# Altium schematic sheet ELEC5550_Team_26_USB_Schematic.SchDoc
size A4; SheetNumber: 3; SheetTotal: 3
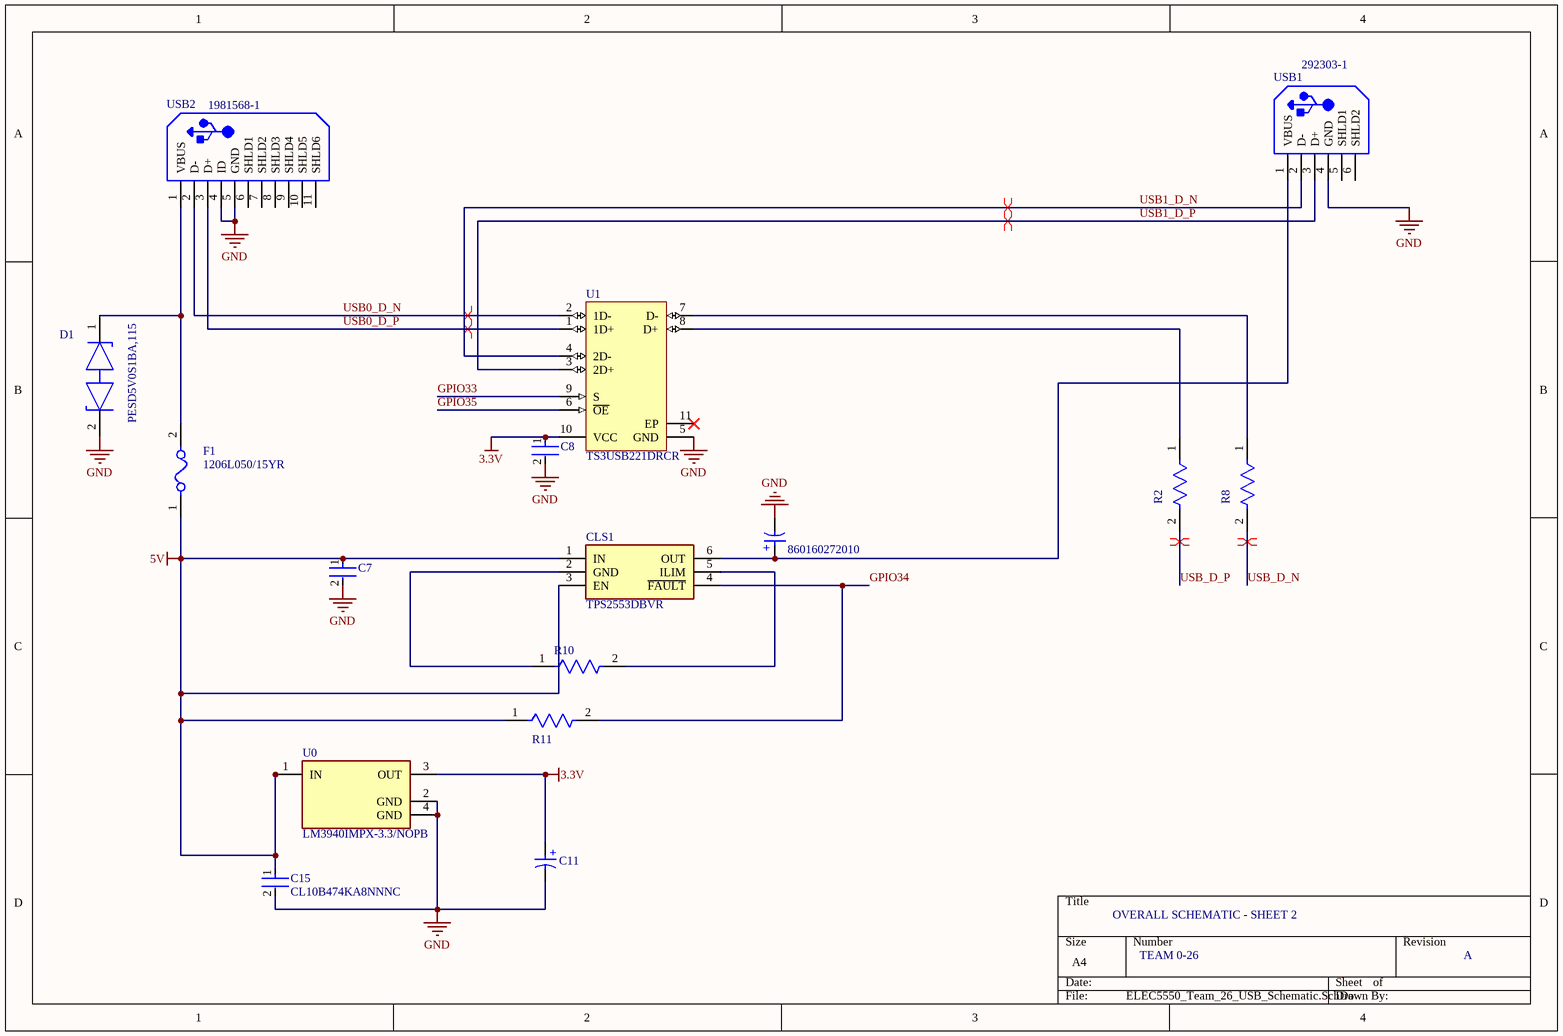
[diagram p0: ELEC5550_Team_26_USB_Schematic.SchDoc]

## Parts
C7  CC0805KRX7R9BB104  [FP-CC0805-0_85-MFG]  (value not drawn)
C8  CC0805KRX7R9BB104  [FP-CC0805-0_85-MFG]  (value not drawn)
C9  860160272010  [WCAP-ATLL_D5H11]
C11  KS336M016C07RR0VH2FP0  [WCAP-ATLL_D5H11]  (value not drawn)
C15  CL10B474KA8NNNC  [FP-GRM188-0_1-e0_2_0_5-MFG]
CLS1  TPS2553DBVR  [SOT95P280X145-6N]
D1  PESD5V0S1BA,115  [FP-SOD323-CA-MFG]
F1  1206L050/15YR  [FP-1206L-MFG]
R2  RC0603JR-0722RL  [FP-RC0603-0_55-IPC_C]  (value not drawn)
R8  RC0603JR-0722RL  [FP-RC0603-0_55-IPC_C]  (value not drawn)
R10  RCT0320KJLF  [FP-RT0603-MFG]  (value not drawn)
R11  RCT03100KJLF  [FP-AT0603-IPC_A]  (value not drawn)
U0  LM3940IMPX-3.3/NOPB  [FP-DCY0004A-MFG]
U1  TS3USB221DRCR  [DRC0010J_V]
USB1  292303-1  [TE-292303-1_V]
USB2  1981568-1  [TECO-1981568-5_V]

## Nets
3.3V: C8.1 C11.1(P) U0.3(OUT) U1.10(VCC)
5V: C7.1 C15.1 CLS1.1(IN) CLS1.3(EN) F1.1 R11.1 U0.1(IN)
GND: C7.2 C8.2 C9.2(N) C11.2(N) C15.2 D1.2(K2) U0.2(GND) U0.4(GND) U1.5(GND) USB1.4(GND) USB2.4(ID) USB2.5(GND)
GPIO33: U1.9(S)
GPIO34: CLS1.4(~{FAULT}) R11.2
GPIO35: U1.6(~{OE})
USB0_D_N: U1.2(1D-) USB2.2(D-)
USB0_D_P: U1.1(1D+) USB2.3(D+)
USB1_D_N: U1.4(2D-) USB1.2(D-)
USB1_D_P: U1.3(2D+) USB1.3(D+)
USB_D_N: R8.2
USB_D_P: R2.2
NetC9_1: C9.1(P) CLS1.6(OUT) USB1.1(VBUS)
NetCLS1_2: CLS1.2(GND) R10.1
NetCLS1_5: CLS1.5(ILIM) R10.2
NetD1_1: D1.1(K1) F1.2 USB2.1(VBUS)
NetR2_1: R2.1 U1.8(D+)
NetR8_1: R8.1 U1.7(D-)

Not connected (* = marked no-connect by the designer): U1 11(EP)*; USB1 5(SHLD1) 6(SHLD2); USB2 6(SHLD1) 7(SHLD2) 8(SHLD3) 9(SHLD4) 10(SHLD5) 11(SHLD6)

## Layout directives
differential pair: USB0_D_N, USB0_D_P, USB1_D_N, USB1_D_P, USB_D_N, USB_D_P

## Notes on the sheet
- OVERALL SCHEMATIC - SHEET 2
- TEAM 0-26
- A
- (in symbol CMP-03913-54007380-1) +
- (in symbol CMP-03913-54007416-1) +

## Library data of the parts
C7 C8 = CMP-2100-03606-3: CAP CER 0.1UF 50V X7R 0805; Manufacturer: Yageo; Tolerance: 0.1; Capacitance: 100 nF; Value: 100 nF; Material: Ceramic; Device Class L1: Passive Components; ComponentLink2Description: Datasheet; Package: CC0805-0.85; Manufacturer Part Number: CC0805KRX7R9BB104; Digikey Description: CAP CER 0.1UF 50V X7R 0805; Device Class L3: Ceramic Capacitors; Temperature: -30°C to +85°C; Temperature Characteristic: X7R; Voltage Rating: 50 V; Height: 0.95mm; RoHS: TRUE; Ipc Land Pattern Name: CAPC200125X85; Device Class L2: Capacitors; Category: Cap; Temperature Range Low: -30°C; Temperature Range High: +85°C; Mouser Description: Multilayer Ceramic Capacitors MLCC - SMD/SMT 100nF 50V X7R 10%; Footprint Url: http://www.yageo.com/exep/pages/download/literatures/UPY-C_GEN_24.pdf; Automotive: No; Octopart: https://octopart.com/cc0805krx7r9bb104-yageo-192993; Lead Free: Yes; ComponentLink2URL: http://www.yageo.com/documents/recent/UPY-GPHC_Y5V_6.3V-to-50V_8.pdf
C9 = CMP-03913-54007380-1: 860160272010 Cap, 120Uf, 10V, Alu Elec, Radial Rohs Compliant: Yes; Capacitance: 120µF; Tolerance: 20%; Life (Hours): 3000hours; Ripple Current: 246mA; Impedance: 1.02Ω; Polarity: Polar; Leakage Current: 12µA; Pitch: 2mm; Length: 11mm; Min Operating Temperature: -55°C; RoHS: Compliant; Packaging: Tape & Box (TB); Height - Seated (Max): 12.4968mm; NexarPartId: 54007380; Lead Pitch: 2.0066mm; Voltage Rating: 10V; Mount: Through Hole; Diameter: 5mm; Max Operating Temperature: 105°C; Case/Package: Radial
C11 = CMP-03913-54007416-1: 860160372005 Aluminium Electrolytic Capacitor-Leaded Rohs Compliant: Yes; Pitch: 2mm; Polarity: Polar; Voltage Rating: 16V; Impedance: 2Ω; Tolerance: 20%; Ripple Current: 144mA; Life (Hours): 4000hours; Capacitance: 33µF; Leakage Current: 5.28µA; Min Operating Temperature: -55°C; Diameter: 5mm; Mount: Through Hole; Packaging: Tape & Box (TB); RoHS: Compliant; NexarPartId: 54007416; Case/Package: Radial; Max Operating Temperature: 105°C; Lead Pitch: 2.0066mm; Length: 11mm; Height - Seated (Max): 12.4968mm
C15 = CMP-2006-02563-2: 25V 470nF X7R ±10% 0603 Multilayer Ceramic Capacitors MLCC - SMD/SMT ROHS; Voltage Rating (DC): 16V; Packaging: Tape and Reel; Termination: SMD/SMT; Length: 1.6mm; Case Code (Metric): 1608; Case Code (Imperial): 0603; Tolerance: 10%; Thickness: 0.035inch; Height: 0.8mm; Width: 0.031inch; Capacitance: 470nF; Dielectric: X7R; Depth: 0.8mm; Radiation Hardening: No; Min Operating Temperature: -55°C; Voltage Rating: 16V; Package Quantity: 10000; Mount: Surface Mount; Max Operating Temperature: 125°C; Case/Package: 0603
CLS1 = TPS2553DBVR: Integrated Circuit; Manufacturer_Name: Texas Instruments; Datasheet Link: http://www.ti.com/lit/gpn/tps2553; Height: 1.45mm; Manufacturer_Part_Number: TPS2553DBVR; Mouser Part Number: 595-TPS2553DBVR; Mouser Price/Stock: https://www.mouser.co.uk/ProductDetail/Texas-Instruments/TPS2553DBVR?qs=QZKT0uTfj2LY8QSfRgrLvA%3D%3D; Arrow Part Number: TPS2553DBVR; Arrow Price/Stock: https://www.arrow.com/en/products/tps2553dbvr/texas-instruments?utm_currency=USD&region=europe
D1 = CMP-14432-000001-1: TVS DIODE 5V 14V SOD323
F1 = CMP-08606-000030-1: PTC RESET FUSE 15V 500MA 1206; Manufacturer: Littelfuse Inc; Trip Time: 0.1s; Trip Current: 1A; Value: 0.15-0.75Ω; Hold Current: 0.5A; Current Rating: 100A; Device Class L2: PTC Resettable Fuses; Height: 0.75mm; Temperature Range High: +85°C; Automotive: No; Package: 1206L; Lead Free: Yes; Mouser Description: Resettable Fuses - PPTC 15V 1206 .500A POLYFUSE; Digikey Description: PTC RESET FUSE 15V 500MA 1206; Manufacturer Part Number: 1206L050/15YR; Voltage Rating: 15V; Temperature Range Low: -40°C; Device Class L3: unset; Device Class L1: Circuit Protection; ComponentLink2URL: https://www.littelfuse.com/~/media/electronics/datasheets/resettable_ptcs/littelfuse_ptc_1206l_datasheet.pdf.pdf; RoHS: TRUE; Ambient Temperature Range High: +85°C; Temperature: -40°C to +85°C; Resistance: 0.15-0.75Ω; Ambient Temperature Range Low: -40°C; Octopart: https://octopart.com/1206l050%2F15yr-littelfuse-673645; ComponentLink2Description: Datasheet; Category: Fuse
R2 R8 = CMP-03412-037819-1: RES SMD 22 OHM 5% 1/10W 0603; Temperature Coefficient: 100ppm/°C; Max Power Dissipation: 100mW; Voltage Rating: 50V; Resistance: 22R; Length: 1.6mm; Tolerance: 5%; Resistance Tolerance: 5%; Number of Terminations: 2; Construction: Rectangular; Min Operating Temperature: -55°C; Lead Free: Lead Free; Width: 0.8mm; Case Code (Imperial): 0603; Voltage Rating (DC): 50V; Case/Package: 0603; Features: Moisture Resistant; REACH SVHC: No SVHC; Military Standard: Not; RoHS Compliant: Yes; Max Operating Temperature: 155°C; Number of Pins: 2; Termination: SMD/SMT; Case Code (Metric): 1608; Packaging: Tape and Reel; Resistor Type: Thick Film; Depth: 0.8mm; Size Code: 0603; Power Rating: 100mW; Series: RC
R10 = CMP-03412-021202-1: RT0603 20KΩ 0.1W 25 ppm/°C 0.10%; Manufacturer Part Number: RT0603BRD1320KL; Manufacturer: Yageo; Tolerance: 0.001; Voltage Rating: 75V; Temperature: -55°C to +155°C; Category: Res; Device Class L3: Chip SMD Resistors; Mouser Description: Thin Film Resistors 1/10W 20K ohm .1% 25ppm; Device Class L1: Passive Components; Series: RT; ComponentLink2URL: http://www.yageo.com/documents/recent/PYu-RT_1-to-0.01_RoHS_L_9.pdf; Footprint Url: http://www.yageo.com/exep/pages/download/literatures/PYu-R_Mount_10.pdf; Composition: Thin Film; Automotive: No; Value: 20KΩ; Ipc Land Pattern Name: RESC16080X45; ComponentLink2Description: Datasheet; RoHS: TRUE; Temperature Range Low: -55°C; Temperature Coefficient: 25 ppm/°C; Height: 0.55mm; Package: RT0603; Lead Free: Yes; Octopart: https://octopart.com/rt0603brd1320kl-yageo-84795393; Power Rating: 0.1W; Device Class L2: Resistors; Temperature Range High: +155°C; Resistance: 20KΩ
R11 = CMP-03412-044027-1: -55℃~+155℃ 100kΩ 100mW 75V Thick Film Resistor ±100ppm/℃ ±5% 0603 Chip Resistor - Surface Mount ROHS; RoHS Compliant: Yes
U0 = CMP-04917-000180-1: IC REG LINEAR 3.3V 1A SOT223-4; Polarity: Positive; Dropout Voltage: 500mV; Number of Regulators: 1; Min Input Voltage: 4.5V; Quiescent Current: 15mA; Output Type: Fixed; Max Input Voltage: 7.5V; Packaging: Tape and Reel; Mount: Surface Mount; Number of Pins: 4; Package Quantity: 2000; Output Current: 1A; Min Operating Temperature: -40°C; Contact Plating: Tin; Max Output Current: 1A; Radiation Hardening: No; Output Voltage: 3.3V; Lead Free: Lead Free; Case/Package: SOT-223; Number of Outputs: 1; Max Operating Temperature: 125°C; RoHS Compliant: Yes
U1 = CMP-0309-00084-2: High-Speed USB 2.0 (480 Mbps) 1:2 Multiplexer / Demultiplexer Switch with Single Enable, 6 ohm RON, 2.5 to 3.3V, -40 to 85 degC, 10-Pin SON (DRC), Green (RoHS & no Sb/Br); Manufacturer: Texas Instruments; Number of Channels: 2; ON Time(Max)(ns): 30; SubFamily: USB Switch; RON Mis-match(Max)(Ohms): 0.2; Vcc range(V): 2.3 to 3.6; tpd max(ns): 0.25; OFF Time(Max)(ns): 12; ron(max)(ohms): 6; ESD HBM(kV): +/-2; Architecture: "1","2 mux/demux"; RON Flatness(Max)(Ohms): 1; Bandwidth(MHz): 1200; IL OFF(Max)(nA): 2; PackageVersion: revL, Sep-2011; Mounting Technology: Surface Mount; ICC(uA): 30; DatasheetVersion: SCDS220G; PartNumber: TS3USB221DRCR; Charge Injection(Max)(pC): N/A; ComponentLink1Description: Datasheet; PackageDescription: 10-Pin Plastic Small Outline No-Lead, 3 x 3 x 1 mm Body, 0.5 mm Pitch, Exposed Pad; ComponentLink2URL: http://www.ti.com/litv/pdf/mpds117k; Eco-Plan: Green (RoHS & no Sb/Br); ComponentLink2Description: Package Specification; ComponentLink1URL: http://www.ti.com/general/docs/lit/getliterature.tsp?genericPartNumber=TS3USB221&fileType=pdf; PackageReference: DRC0010J
USB1 = CMP-2000-05404-1: 1 Port Right Angle Through Hole Mount Female Type A USB Connector, 4 Position, -55 to 85 degC, RoHS, Tube; Manufacturer: TE Connectivity; Contact Termination Type: Solder; No. of Contacts: 4; Connector Mounting: PCB; SVHC: NoSVHC(16-Jun-2014); Gender: Receptacle; Connector Type: USBA; Package Description: 4-Pin Through Hole Device, Body 14 x 13.13 mm, Pitch 2.5 mm; Contact Plating: Gold; Package Reference: 292303-1; Contact Material: Copper; Datasheet URL: http://www.farnell.com/cad/1653030.pdf; Datasheet Version: Feb-12; Manufacturer URL: http://www.te.com/
USB2 = CMP-2000-05408-1: Micro USB Receptacle Standard Type B Assy, 5-Pin SMD, RoHS, Tape and Reel; Manufacturer: TE Connectivity; Body Orientation: RightAngle; Number of Ports: 1Port; Number of Contacts: 5POS; Gender: RCP; Voltage Rating Max: 30VAC; Product Depth (mm): 5.6mm; Pitch (mm): 0.65mm; Current Rating (Max): 1/ContactA; Product Length (mm): 8mm; Product Height (mm): 3mm; Operating Temperature Max Deg. C: 85C; Datasheet URL: http://www.mouser.com/ds/2/418/NG_CD_1981568_E2-621296.pdf; Termination Method: Solder; Number of Terminals: 5; Operating Temp Range: -55Cto85C; Mounting Style: SurfaceMount; Manufacturer URL: http://www.te.com/; Contact Material: CopperAlloy; Packaging: TapeandReel; Datasheet Version: Rev. E2, 08/2015; Operating Temperature Min Deg. C: -55C; Housing Material: Thermoplastic; Type: MicroUSB; Contact Plating: GoldOverNickel